# EAGLE design main (EAGLE 5.06)
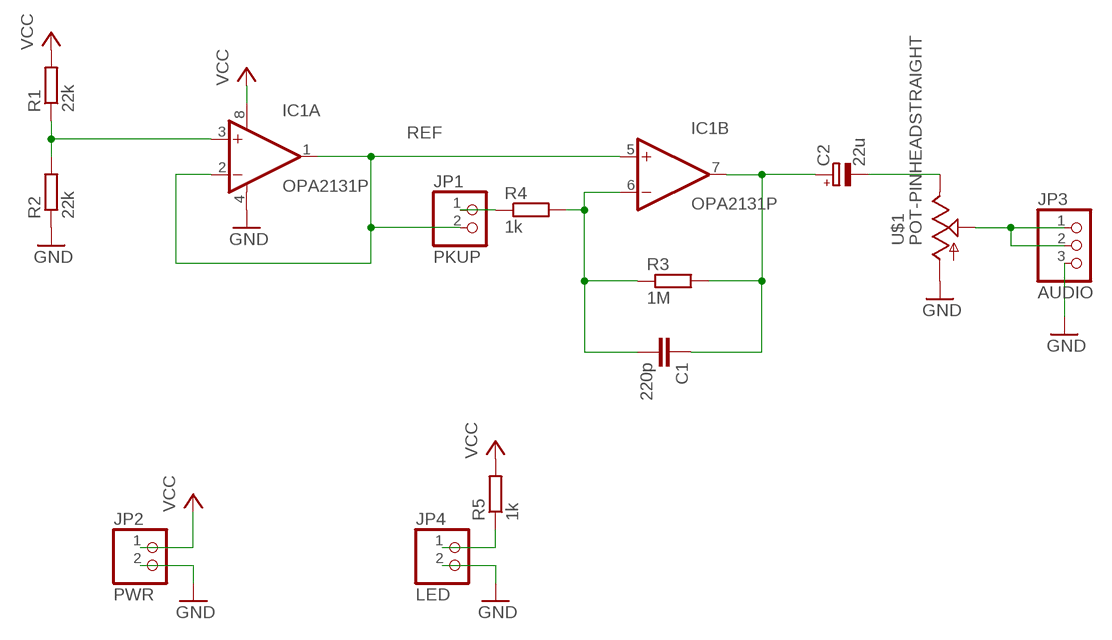
[diagram p0: schematic, sheet 1]

## Parts
C1  220p  C-EUC0603  [C0603]
C2  22u  CPOL-EUE2-4  [E2-4]
IC1  OPA2131P  [DIL08]
JP1  PKUP  PINHD-1X2STRAIGHT  [1X02]
JP2  PWR  PINHD-1X2STRAIGHT  [1X02]
JP3  AUDIO  PINHD-1X3  [1X03]
JP4  LED  PINHD-1X2STRAIGHT  [1X02]
R1  22k  R-EU_R0805  [R0805]
R2  22k  R-EU_R0805  [R0805]
R3  1M  R-EU_R0805  [R0805]
R4  1k  R-EU_R0805  [R0805]
R5  1k  R-EU_R0805  [R0805]
U$1  POT-PINHEADSTRAIGHT  [PIN-1X03]

## Nets
GND: IC1.4(A:V-) JP2.2 JP3.3 JP4.2 R2.1 U$1.1(A)
N$1: IC1.3(A:+IN) R1.1 R2.2
N$2: C1.2 IC1.6(B:-IN) R3.1 R4.2
N$3: C1.1 C2.+ IC1.7(B:OUT) R3.2
N$4: JP1.1 R4.1
N$5: C2.- U$1.3(E)
N$6: JP3.1 JP3.2 U$1.2(S)
N$7: JP4.1 R5.1
REF: IC1.1(A:OUT) IC1.2(A:-IN) IC1.5(B:+IN) JP1.2
VCC: IC1.8(A:V+) JP2.1 R1.2 R5.2

## Library data of the parts
C1 = rcl:C-EU: CAPACITOR, European symbol
C2 = rcl:CPOL-EU: POLARIZED CAPACITOR, European symbol
IC1 = burr-brown:OPA2131: General Purpose FET-Input Operational Amplifiers Product Folder:OPA2131
JP1 JP2 JP4 = pinhead:PINHD-1X2: PIN HEADER
JP3 = pinhead:PINHD-1X3: PIN HEADER
R1-R5 = rcl:R-EU_: RESISTOR, European symbol
U$1 = adam - mechanical:POT-PINHEAD

## Board
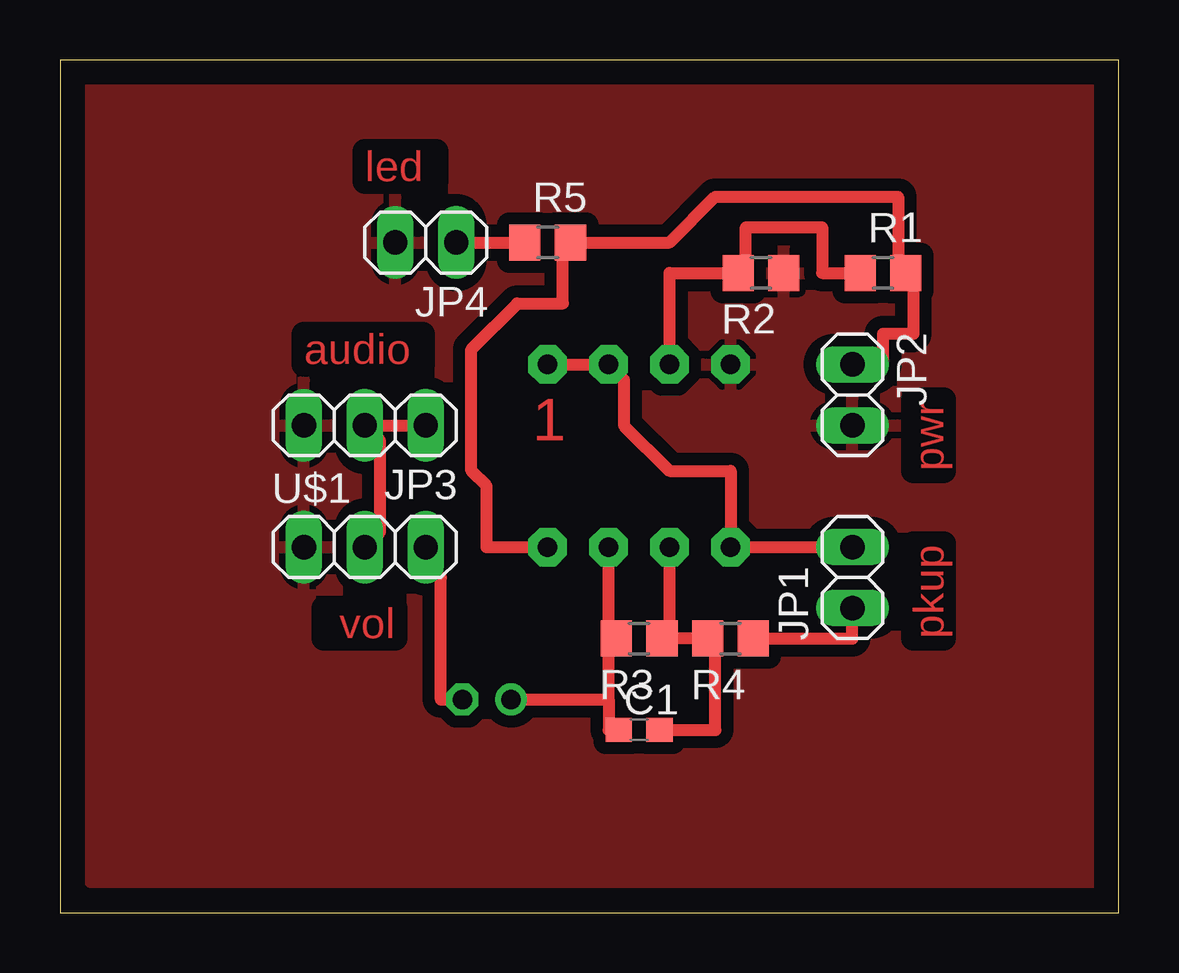
[diagram p1: board, top side]
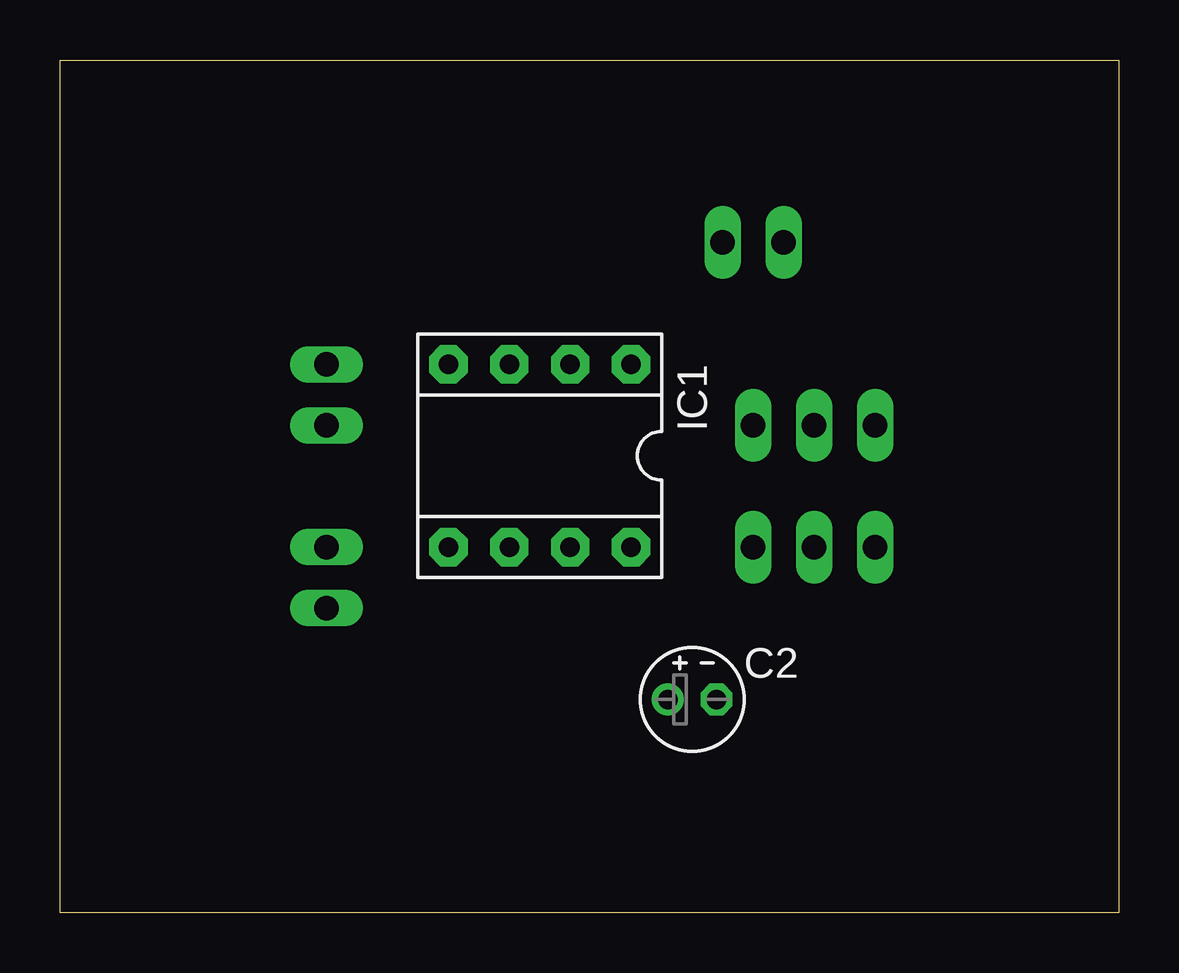
[diagram p2: board, bottom side, seen from below]

Size 44.12 x 35.55 mm. Coordinates in mm from the lower left corner, seen from the top.
Outline: 0,0 44.12,0 44.12,35.55 0,35.55 0,0
Copper layers (1*16): Top 0.035mm / dielectric 1.5mm / Bottom 0.035mm
Design rules "default *": minimum track width 20mil, minimum drill 24mil, track to track 20mil, track to pad 20mil, pad to pad 12mil, via to via 12mil, smd to smd 8mil, copper to edge 40mil, drill to drill 8mil, minimum pad ring 10mil, minimum via ring 8mil, stop-mask expansion 4mil, vias tented up to drill 0mil, thermal gap 10mil

### Footprints (pad centres in the part's own frame; a part is rotated, then mirrored left to right if it is on the bottom)
C0603 = smd 1.1 x 1: 1 -0.85,0; 2 0.85,0
E2-4 = drill 0.813 pad 1.27 round: + -1.016,0 | drill 0.813 pad 1.27 octagon: - 1.016,0
DIL08 = drill 0.813 pad 1.6 octagon: 1 -3.81,-3.81; 2 -1.27,-3.81; 3 1.27,-3.81; 4 3.81,-3.81; 5 3.81,3.81; 6 1.27,3.81; 7 -1.27,3.81; 8 -3.81,3.81
1X02 = drill 1.016 long: 1 -1.27,0; 2 1.27,0
1X03 = drill 1.016 long: 1 -2.54,0; 2 0,0; 3 2.54,0
R0805 = smd 1.3 x 1.5: 1 -0.95,0; 2 0.95,0
PIN-1X03 = drill 1.016 long: 1 -2.54,0; 2 0,0; 3 2.54,0

### Placement (x,y rotation side)
C1  24.13,7.62 0 top
C2  17.78,8.89 0 bottom
IC1  24.13,19.05 180 bottom
JP1  33.02,13.97 90 top
JP2  33.02,21.59 270 top
JP3  12.7,20.32 180 top
JP4  15.24,27.94 180 top
R1  34.29,26.67 0 top
R2  29.21,26.67 180 top
R3  24.13,11.43 180 top
R4  27.94,11.43 180 top
R5  20.32,27.94 0 top
U$1  12.7,15.24 0 top

### Tracks (layer width: path | path; a pad name or v marks a point on that pad's centre or on a via)
GND
  pour Top: 1.27,35.56 43.18,35.56 43.18,1.27 1.27,1.27
N$1
  Top 0.508: IC1.3 25.4,26.67 R2.2 28.57,26.67 28.57,28.57 31.75,28.57 31.75,26.67 R1.1
N$2
  Top 0.508: C1.2 27.3,7.62 27.3,11.43 R4.2 25.4,11.43 | 25.4,11.43 IC1.6 | 25.4,11.43 R3.1
N$3
  Top 0.508: 22.86,8.89 22.86,11.43 | 22.86,8.89 22.86,7.62 C1.1 | C2.+ 22.86,8.89 | 22.86,11.43 IC1.7 | 22.86,11.43 R3.2
N$4
  Top 0.508: JP1.1 33.02,11.43 R4.1
N$5
  Top 0.508: U$1.3 15.24,14.61 15.87,13.97 15.87,8.89 C2.-
N$6
  Top 0.508: U$1.2 13.33,15.88 13.33,19.68 JP3.2 JP3.1
N$7
  Top 0.508: JP4.1 R5.1
REF
  Top 0.508: IC1.1 IC1.2 23.5,22.23 23.5,20.32 25.4,18.41 27.94,18.41 IC1.5 JP1.2
VCC
  Top 0.508: JP2.1 34.29,22.86 34.29,24.13 35.56,24.13 35.56,26.67 R1.2 34.92,26.67 34.92,29.84 27.3,29.84 25.4,27.94 R5.2 20.96,27.94 20.96,25.4 19.05,25.4 17.14,23.5 17.14,18.41 17.78,17.78 17.78,15.24 IC1.8

### Text on the board
Top: led | audio | 1 | pwr | vol | pkup